# EAGLE design OGX360I-4CH - Middle Man P3 - P4 (EAGLE 9.6.2)
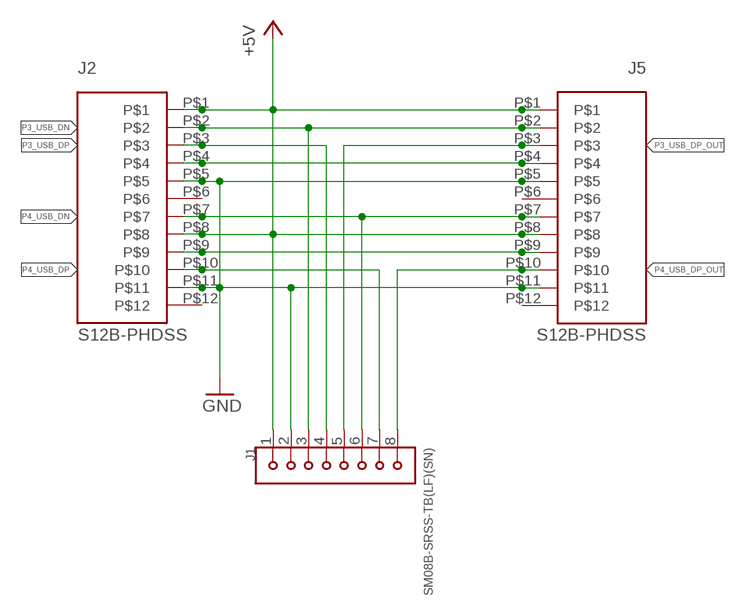
[diagram p0: schematic, sheet 1]

## Parts
J1  SM08B-SRSS-TB(LF)(SN)  [JST_SM08B-SRSS-TB(LF)(SN)]
J2  S12B-PHDSS  [S12B-PHDSS]
J5  S12B-PHDSS  [S12B-PHDSS]

## Nets
+5V: J1.1 J2.P$1 J2.P$8 J5.P$1 J5.P$8
GND: J1.2 J2.P$5 J2.P$11 J5.P$5 J5.P$11
N$2: J2.P$4 J5.P$4
N$6: J2.P$9 J5.P$9
P3_USB_DN: J1.3 J2.P$2 J5.P$2
P3_USB_DP: J1.4 J2.P$3
P3_USB_DP_OUT: J1.5 J5.P$3
P4_USB_DN: J1.6 J2.P$7 J5.P$7
P4_USB_DP: J1.7 J2.P$10
P4_USB_DP_OUT: J1.8 J5.P$10
Unconnected: J2.P$6 J2.P$12 J5.P$6 J5.P$12

## Library data of the parts
J1 = SM08B-SRSS-TB_LF__SN_:SM08B-SRSS-TB(LF)(SN): SH Series 8 Position 1 mm Pitch Surface Mount Side Entry Shrouded Header; AVAILABILITY: Unavailable; DESCRIPTION: Connector Header Surface Mount, Right Angle 8 position 0.039 _1.00mm_; MF: JST Sales; MP: SM08B-SRSS-TB_LF__SN_; PACKAGE: None; PRICE: None
J2 J5 = S12B-PHDSS:S12B-PHDSS

## Board
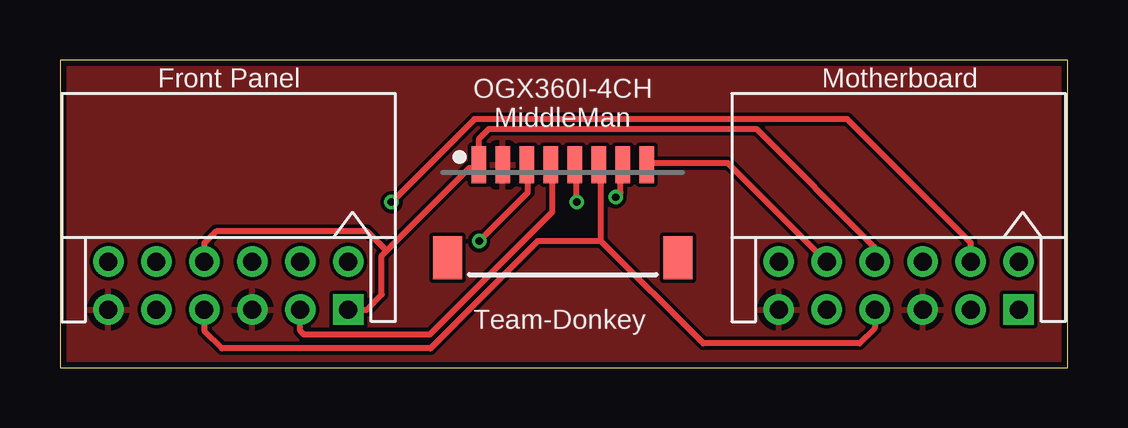
[diagram p1: board, top side]
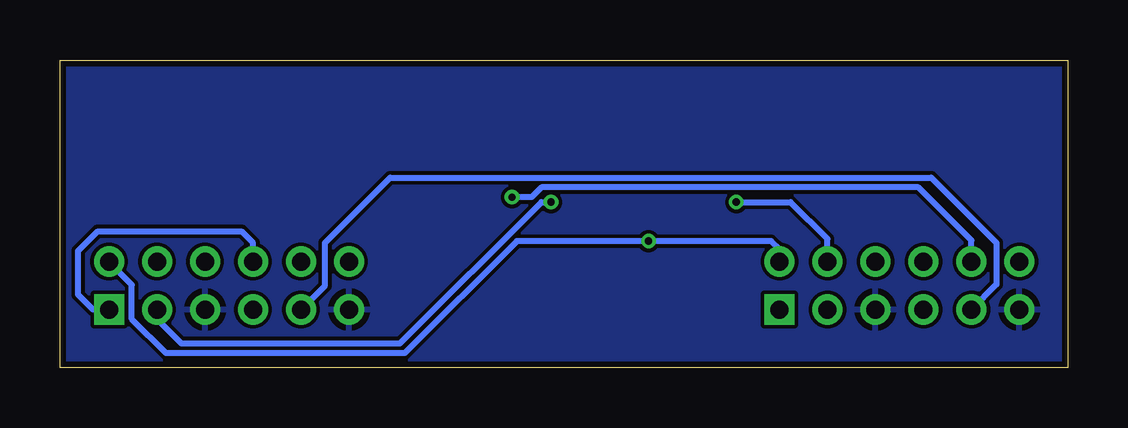
[diagram p2: board, bottom side, seen from below]

Size 42.01 x 12.83 mm. Coordinates in mm from the lower left corner, seen from the top.
Outline: 0,0 42.01,0 42.01,12.83 0,12.83 0,0
Copper layers (1*16): Top 0.035mm / dielectric 0.15mm / Bottom 0.035mm
Design rules "default *": minimum track width 10mil, minimum drill 12mil, track to track 6mil, track to pad 6mil, pad to pad 6mil, via to via 6mil, smd to smd 0mil, copper to edge 10mil, drill to drill 10mil, minimum pad ring 10mil, minimum via ring 6mil, stop-mask expansion 2mil, vias tented up to drill 100mil, thermal gap 10mil

### Footprints (pad centres in the part's own frame; a part is rotated, then mirrored left to right if it is on the bottom)
JST_SM08B-SRSS-TB(LF)(SN) = smd 0.6 x 1.55: 1 -3.5,4.775; 2 -2.5,4.775; 3 -1.5,4.775; 4 -0.5,4.775; 5 0.5,4.775; 6 1.5,4.775; 7 2.5,4.775; 8 3.5,4.775 | smd 1.2 x 1.8: P1 -4.8,0.9; P2 4.8,0.9
S12B-PHDSS = drill 0.75 square: P$1 1.95,9 | drill 0.75: P$2 1.95,7; P$3 3.95,9; P$4 3.95,7; P$5 5.95,9; P$6 5.95,7; P$7 7.95,9; P$8 7.95,7; P$9 9.95,9; P$10 9.95,7; P$11 11.95,9; P$12 11.95,7

### Placement (x,y rotation side)
J1  20.95,3.68 0 top
J2  13.97,11.43 180 top
J5  41.91,11.43 180 top

### Tracks (layer width: path | path; a pad name or v marks a point on that pad's centre or on a via)
+5V
  Top 0.254: 13.61,4.88 13.41,4.67 13.41,3.05 12.79,2.43 J2.P$1 | 13.61,4.88 17.07,8.33 17.27,8.33 J1.1 17.48,8.53 17.48,9.55 17.88,9.96 29.03,9.96 33.93,5.05 33.93,4.47 J5.P$8 | J2.P$8 6.02,5.19 6.52,5.69 12.8,5.69 13.61,4.88
  Bottom 0.254: J5.P$8 33.96,5.21 34.44,5.69 40.44,5.69 41.25,4.88 41.25,3.05 40.64,2.44 40.03,2.44 J5.P$1
GND
  pour Bottom: -2.54,15.24 44.45,15.24 44.45,-2.54 -2.54,-2.54
  pour Top: -1.27,13.97 43.18,13.97 43.18,-1.27 -1.27,-1.27
N$2  (via drill 0.3)
  Top 0.254: v13.82,6.91 17.27,10.36 32.82,10.36 37.96,5.22 J5.P$4
  Bottom 0.254: J2.P$4 10.02,5.37 11.56,6.91 v13.82,6.91
N$6
  Bottom 0.254: J2.P$9 2.97,3.48 2.97,5.21 5.69,7.92 28.25,7.92 30.96,5.21 30.96,3.43 J5.P$9
P3_USB_DN  (via drill 0.3)
  Top 0.254: v17.48,5.28 19.51,7.32 19.51,8.33 J1.3
  Bottom 0.254: J2.P$2 12.02,4.93 12.37,5.28 v17.48,5.28 22.96,5.28 27.64,0.61 37.59,0.61 39.01,2.03 39.01,3.45 39.83,4.27 J5.P$2
P3_USB_DP
  Top 0.254: J1.4 20.52,8.33 20.52,6.5 15.42,1.4 10.16,1.4 10.02,1.54 J2.P$3
P3_USB_DP_OUT  (via drill 0.3)
  Top 0.254: v21.54,6.91 21.54,8.33 J1.5
  Bottom 0.254: v21.54,6.91 21.95,6.91 27.84,1.02 36.96,1.02 37.96,2.02 J5.P$3
P4_USB_DN
  Top 0.254: 22.55,5.28 22.55,8.33 J1.6 | 22.55,5.28 26.82,1.02 33.33,1.02 33.96,1.65 J5.P$7 | J2.P$7 6.02,1.55 6.76,0.81 15.44,0.81 19.91,5.28 22.55,5.28
P4_USB_DP  (via drill 0.3)
  Top 0.254: v23.16,7.11 23.37,7.32 23.37,8.33 J1.7
  Bottom 0.254: v23.16,7.11 22.35,7.11 21.95,7.52 6.22,7.52 4.02,5.32 J2.P$10
P4_USB_DP_OUT
  Top 0.254: J1.8 24.59,8.53 27.84,8.53 31.9,4.47 J5.P$10

### Text on the board
tPlace: Front Panel | Motherboard | OGX360I-4CH / MiddleMan | Team-Donkey